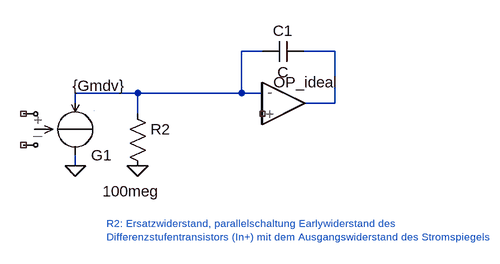
[diagram p0: schematic op_freq_resp_noninv.asc]
op_freq_resp_noninv.asc, the LTspice schematic file:
Version 4
SHEET 1 1516 680
WIRE 128 112 96 112
WIRE 240 112 192 112
WIRE -64 176 -160 176
WIRE 96 176 96 112
WIRE 96 176 -64 176
WIRE 128 176 96 176
WIRE -160 192 -160 176
WIRE 240 192 240 112
WIRE 240 192 192 192
WIRE -64 208 -64 176
WIRE -160 288 -160 272
FLAG -64 288 0
FLAG -160 288 0
SYMBOL EIT_Semiconductors\\op_3 160 192 R0
WINDOW 123 -37 49 Invisible 2
WINDOW 3 -16 43 Invisible 2
SYMATTR InstName OP_ideal
SYMATTR Value2 FT=10000Meg SR=10k
SYMBOL res -80 192 R0
WINDOW 3 -38 135 Left 2
SYMATTR InstName R2
SYMATTR Value 100meg
SYMBOL crtl-V-I_INV -160 176 R0
WINDOW 3 -4 -11 Left 2
SYMATTR InstName G1
SYMATTR Value {Gmdv}
SYMBOL cap 192 128 M270
WINDOW 0 32 32 VTop 2
WINDOW 3 0 32 VBottom 2
SYMATTR InstName C1
TEXT -112 376 Left 1 ;R2: Ersatzwiderstand, parallelschaltung Earlywiderstand des\nDifferenzstufentransistors (In+) mit dem Ausgangswiderstand des Stromspiegels

The netlist it stands for:
* op_freq_resp_noninv.asc
XOP_ideal NC_01 N001 N002 opamp_param_3 Vp=10 Vm=-10 Ilim=20m FT=10000Meg SR=10k Vos=0 A0=100k phir=45 en=0 enk=0 in=0 ink=0 Rin=500Meg  ; pins In+ In- OUT
R2 N001 0 100meg
G1 N001 0 NC_02 NC_03 {Gmdv}
C1 N002 N001 C
* R2: Ersatzwiderstand, parallelschaltung Earlywiderstand des
* Differenzstufentransistors (In+) mit dem Ausgangswiderstand des Stromspiegels
.lib EIT_sub\opamp_parametrierbar.sub
.backanno
.end